# Altium project ROBOT_PCB_PROJECT.PrjPcb (part 1 of 2)
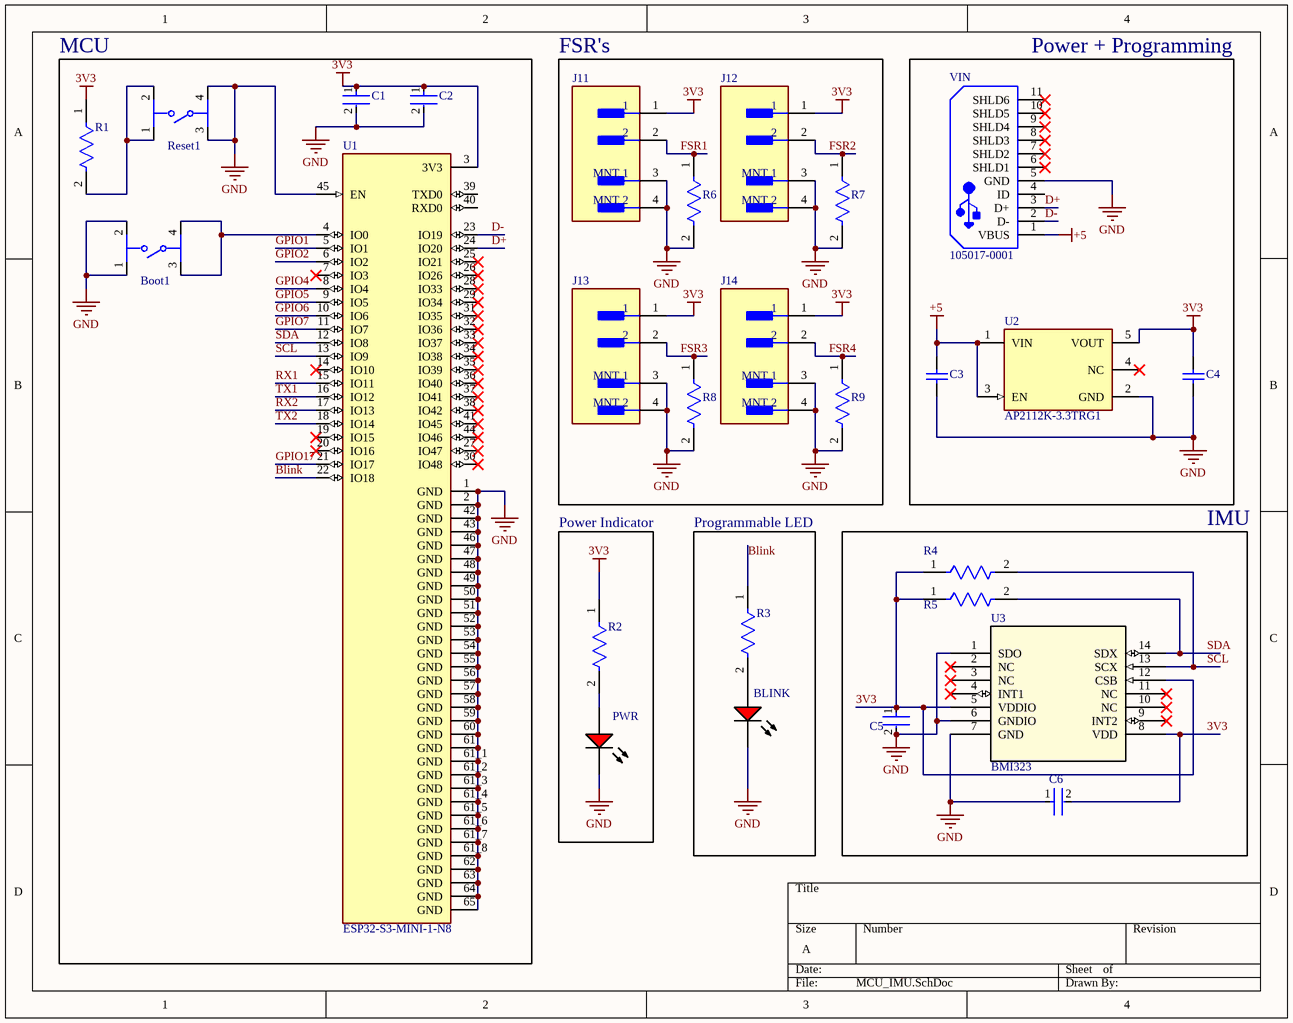
[diagram p0: MCU_IMU.SchDoc]
4 sheets, 150 parts. Net scope: global (net labels, ports and power ports of the same name join across sheets).
Board file: ROBOT_MOTHERBOARD.PcbDoc
Sheets:
  MCU_IMU.SchDoc
  UART_LOGIC.SchDoc
  Battery_power.SchDoc
  Jetson_power.SchDoc

## Sheet MCU_IMU.SchDoc
size A; SheetNumber: 1; SheetTotal: 4

### Parts
BLINK  SML-LX1206IC-TR  [LUMX-SML-LX1206IC_V]  (value not drawn)
Boot1  PTS810SJM250SMTRLFS  [FP-PTS810SJM250SMTRLFS-MFG]  (value not drawn)
C1  CC0805KRX7R9BB104  [FP-CC0805-0_85-MFG]  (value not drawn)
C2  CC0805KRX7R9BB104  [FP-CC0805-0_85-MFG]  (value not drawn)
C3  C0805C105K5RACTU  [CAPC2013X140X50ML20T25]  (value not drawn)
C4  C0805C105K5RACTU  [CAPC2013X140X50ML20T25]  (value not drawn)
C5  CC0805KRX7R9BB104  [FP-CC0805-0_85-MFG]  (value not drawn)
C6  CC0805KRX7R9BB104  [FP-CC0805-0_85-MFG]  (value not drawn)
J11  BM02B-SRSS-TBT(LF)(SN)  [FP-BM02B-SRSS-TBT_LF_SN-MFG]  (value not drawn)
J12  BM02B-SRSS-TBT(LF)(SN)  [FP-BM02B-SRSS-TBT_LF_SN-MFG]  (value not drawn)
J13  BM02B-SRSS-TBT(LF)(SN)  [FP-BM02B-SRSS-TBT_LF_SN-MFG]  (value not drawn)
J14  BM02B-SRSS-TBT(LF)(SN)  [FP-BM02B-SRSS-TBT_LF_SN-MFG]  (value not drawn)
PWR  SML-LX1206IC-TR  [LUMX-SML-LX1206IC_V]  (value not drawn)
R1  CRCW08054K70FKEA  [FP-CRCW0805-e3-IPC_B]  (value not drawn)
R2  CRCW08054K70FKEA  [FP-CRCW0805-e3-IPC_B]  (value not drawn)
R3  CRCW08054K70FKEA  [FP-CRCW0805-e3-IPC_B]  (value not drawn)
R4  CRCW08054K70FKEA  [FP-CRCW0805-e3-IPC_B]  (value not drawn)
R5  CRCW08054K70FKEA  [FP-CRCW0805-e3-IPC_B]  (value not drawn)
R6  RC0603FR-0710KL  [FP-RC0603-0_55-IPC_C]  (value not drawn)
R7  RC0603FR-0710KL  [FP-RC0603-0_55-IPC_C]  (value not drawn)
R8  RC0603FR-0710KL  [FP-RC0603-0_55-IPC_C]  (value not drawn)
R9  RC0603FR-0710KL  [FP-RC0603-0_55-IPC_C]  (value not drawn)
Reset1  PTS810SJM250SMTRLFS  [FP-PTS810SJM250SMTRLFS-MFG]  (value not drawn)
U1  ESP32-S3-MINI-1-N8  [XCVR_ESP32-S3-MINI-1-N8]
U2  AP2112K-3.3TRG1  [FP-SOT25-IPC_A]
U3  BMI323  [BMI323_BOS]
VIN  105017-0001  [USB-MICRO-B_V]

### Blocks framed on the sheet
MCU: Boot1 C1 C2 R1 Reset1 U1
FSR's: J11-J14 R6-R9
Power + Programming: C3 C4 U2 VIN
Power Indicator: PWR R2
Programmable LED: BLINK R3
IMU: C5 C6 R4 R5 U3

### Nets
3V3: C1.1 C2.1 C4.2 C5.1 C6.2 J11.1 J12.1 J13.1 J14.1 R1.1 R2.1 R4.1 R5.1 U1.3(3V3) U2.5(VOUT) U3.5(VDDIO) U3.8(VDD) U3.12(CSB)
+5: C3.2 U2.1(VIN) U2.3(EN) VIN.1(VBUS)
GND: BLINK.2(K) Boot1.1 Boot1.2 C1.2 C2.2 C3.1 C4.1 C5.2 C6.1 J11.3(MNT_1) J11.4(MNT_2) J12.3(MNT_1) J12.4(MNT_2) J13.3(MNT_1) J13.4(MNT_2) J14.3(MNT_1) J14.4(MNT_2) PWR.2(K) R6.2 R7.2 R8.2 R9.2 Reset1.3 Reset1.4 U1.1(GND) U1.2(GND) U1.42(GND) U1.43(GND) U1.45(EN) U1.46(GND) U1.47(GND) U1.48(GND) U1.49(GND) U1.50(GND) U1.51(GND) U1.52(GND) U1.53(GND) U1.54(GND) U1.55(GND) U1.56(GND) U1.57(GND) U1.58(GND) U1.59(GND) U1.60(GND) U1.61(GND) U1.61_1(GND) U1.61_2(GND) U1.61_3(GND) U1.61_4(GND) U1.61_5(GND) U1.61_6(GND) U1.61_7(GND) U1.61_8(GND) U1.62(GND) U1.63(GND) U1.64(GND) U1.65(GND) U2.2(GND) U3.1(SDO) U3.6(GNDIO) U3.7(GND) VIN.5(GND)
Blink: R3.1 U1.22(IO18)
D+: U1.24(IO20) VIN.3(D+)
D-: U1.23(IO19) VIN.2(D-)
FSR1: J11.2 R6.1
FSR2: J12.2 R7.1
FSR3: J13.2 R8.1
FSR4: J14.2 R9.1
GPIO1: U1.5(IO1)
GPIO2: U1.6(IO2)
GPIO4: U1.8(IO4)
GPIO5: U1.9(IO5)
GPIO6: U1.10(IO6)
GPIO7: U1.11(IO7)
GPIO17: U1.21(IO17)
RX1: U1.15(IO11)
RX2: U1.17(IO13)
SCL: R4.2 U1.13(IO9) U3.13(SCX)
SDA: R5.2 U1.12(IO8) U3.14(SDX)
TX1: U1.16(IO12)
TX2: U1.18(IO14)
NetBLINK_1: BLINK.1(A) R3.2
NetBoot1_3: Boot1.3 Boot1.4 U1.4(IO0)
NetPWR_1: PWR.1(A) R2.2
NetR1_2: R1.2 Reset1.1 Reset1.2

Not connected (* = marked no-connect by the designer): U1 7(IO3)* 14(IO10)* 19(IO15)* 20(IO16)* 25(IO21)* 26(IO26)* 27(IO47)* 28(IO33)* 29(IO34)* 30(IO48)* 31(IO35)* 32(IO36)* 33(IO37)* 34(IO38)* 35(IO39)* 36(IO40)* 37(IO41)* 38(IO42)* 39(TXD0) 40(RXD0) 41(IO45)* 44(IO46)*; U2 4(NC)*; U3 2(NC)* 3(NC)* 4(INT1)* 9(INT2)* 10(NC)* 11(NC)*; VIN 4(ID) 6(SHLD1)* 7(SHLD2)* 8(SHLD3)* 9(SHLD4)* 10(SHLD5)* 11(SHLD6)*

### Library data of the parts
BLINK PWR = CMP-2000-07123-1: LED Red, 65 mW, -40 to 85 degC, 2-Pin SMD, RoHS, Tape and Reel; Manufacturer: Lumex; LED Material: GaAsP; Peak Wavelength: 635nm; Number of LEDs: 1; Viewing Angle: 160; Reverse Voltage: 5(Min)V; Lens Appearance: ColorlessNonDiffused; Intensity: 6mcd; Pin_Count: 2; Lens Dimensions: 2x1.6x0.5mm; Mounting: SurfaceMount; ECCN: EAR99; RoHS: Unknown; Package Description: 2-Pin Surface Mount Device, Body 3.2 x 1.5 mm; Mounting Technology: SurfaceMount; Dominant Wavelength: N/A; Supplier_Package: SMD; Supplier Standard Pack: 3,000; Color: Red; Dimension: 3.2x1.6x1.1mm; HTS: 8541402000; Part No: SML-LX1206IC-TR; Family: SML-LX1206IC; Supplier: Lumex; Datasheet URL: http://www.lumex.com/content/files/ProductAttachment/SML-LX1206IC-TR.pdf; Package Reference: SML-LX1206IC; Manufacturer URL: http://www.lumexinstruments.com/; Type: Uni-Color; Operating Temperature: -25to85C; Packaging: TapeandReel; Datasheet Version: Rev. J, 08/2012
Boot1 Reset1 = CMP-10040-000001-2: SWITCH TACTILE SPST-NO 0.05A 16V; Throw Configuration: SPST; Operating Force: 160gf; Actuator Type: Standard; Switch Travel: 0.15mm; Switch Function: Off-Mom; Max Current Rating: 50mA; Mechanical Life: 150000Cycles; Illumination Type: Non-Illuminated; Package Quantity: 2900; Depth: 4.6mm; Mount: Surface Mount; Packaging: Tape and Reel; Length: 3.2mm; RoHS Compliant: Yes; Case/Package: SMD/SMT; Voltage Rating (DC): 16V; Min Operating Temperature: -40°C; Termination: J-Bend; Lead Free: Lead Free; Contact Plating: Silver; Orientation: Straight; Max Operating Temperature: 85°C; Current Rating: 50mA; Color: Black
C1 C2 C5 C6 = CMP-2100-03606-3: CAP CER 0.1UF 50V X7R 0805; Manufacturer: Yageo; Tolerance: 0.1; Capacitance: 100 nF; Value: 100 nF; Material: Ceramic; Device Class L1: Passive Components; ComponentLink2Description: Datasheet; Package: CC0805-0.85; Manufacturer Part Number: CC0805KRX7R9BB104; Digikey Description: CAP CER 0.1UF 50V X7R 0805; Device Class L3: Ceramic Capacitors; Temperature: -30°C to +85°C; Temperature Characteristic: X7R; Voltage Rating: 50 V; Height: 0.95mm; RoHS: TRUE; Ipc Land Pattern Name: CAPC200125X85; Device Class L2: Capacitors; Category: Cap; Temperature Range Low: -30°C; Temperature Range High: +85°C; Mouser Description: Multilayer Ceramic Capacitors MLCC - SMD/SMT 100nF 50V X7R 10%; Footprint Url: http://www.yageo.com/exep/pages/download/literatures/UPY-C_GEN_24.pdf; Automotive: No; Octopart: https://octopart.com/cc0805krx7r9bb104-yageo-192993; Lead Free: Yes; ComponentLink2URL: http://www.yageo.com/documents/recent/UPY-GPHC_Y5V_6.3V-to-50V_8.pdf
C3 C4 = CMP-2007-03236-1: Manufacturer: Kemet; Part Number: C0805C105K5RACTU
J11-J14 = CMP-17439-000179-1: CONN WIRE HDR 2POS 1MM STSMD; Mated Stacking Heights: 4.9mm; Max Current Rating: 1A; Pitch: 0.039inch; Contact Resistance: 20mR; Max Voltage Rating (DC): 50V; Connector Type: Header; Number of Positions: 2; Insulation Material: Nylon; Termination: Solder; Contact Plating: Tin; Mount: Surface Mount; Package Quantity: 1500; Housing Color: Natural; Orientation: Straight; Max Operating Temperature: 85°C; Min Operating Temperature: -25°C; Length: 4mm; Lead Free: Lead Free; Contact Type: Male Pin; Depth: 3.6mm; Contact Material: Copper Alloy; Packaging: Tape and Reel; Number of Rows: 1; Contact Shape: Square; Flammability Rating: UL94 V-0; Voltage Rating: 50V; Color: Natural; Contact Finish - Mating: TIN; Fastening Type: Pull; Insulation Color: Natural; Series: SR; Max Voltage Rating (AC): 50V; Housing Material: Polyamide
R1-R5 = CMP-2100-03615-2: RES Thick Film, 4.7kΩ, 1%, 0.125W, 100ppm/°C, 0805; Max Power Dissipation: 125mW; Resistance: 4.7kR; Voltage Rating: 150V; Termination: SMD/SMT; Weight: 0.000194oz; Case/Package: 0805; Number of Terminations: 2; Min Operating Temperature: -55°C; Case Code (Metric): 2012; Package Quantity: 10; Depth: 1.25mm; Military Standard: Not; Composition: Thick Film; Radiation Hardening: No; Contact Plating: Tin; Height: 0.45mm; Power Rating: 125mW; Features: Automotive AEC-Q200; Tolerance: 1%; Packaging: Tape and Reel; Max Operating Temperature: 155°C; Length: 2mm; Case Code (Imperial): 0805; Voltage Rating (DC): 150V; Width: 1.25mm; Temperature Coefficient: 100ppm/°C; Lead Free: Lead Free
R6-R9 = CMP-2100-03664-2: RES 10K OHM 1% 1/10W 0603; Voltage Rating: 75V; Voltage Rating (DC): 50V; Resistance: 10kR; Power Rating: 100mW; Temperature Coefficient: 100ppm/°C; Depth: 0.8mm; Termination: SMD/SMT; Resistor Type: Thick Film; Series: RC; Construction: Rectangular; Features: Moisture Resistant; Packaging: Tape and Reel; Min Operating Temperature: -55°C; Number of Terminations: 2; Lead Pitch: 0.3mm; RoHS Compliant: Yes; Case/Package: 0603; Resistance Tolerance: 1%; Military Standard: Not; Weight: 7.1E-05oz; Number of Pins: 2; Tolerance: 1%; Length: 1.6mm; Case Code (Imperial): 0603; Lead Free: Lead Free; Width: 0.8mm; Max Power Dissipation: 100mW; Height: 0.45mm; Max Operating Temperature: 155°C; Case Code (Metric): 1608; Size Code: 0603
U1 = CMP-025-000000-2: MF: {'manufacturer': u'Espressif Systems'}; Pin Count: 73; Component Type: Standard; Design Item ID: ESP32-S3-MINI-1-N8; Source: ESP32-S3-MINI-1-N8.SchLib; MP: ESP32-S3-MINI-1-N8; Price: None; Package: None; Value: *
U2 = CMP-12756-000035-1: IC REG LINEAR 3.3V 600MA SOT25; Number of Regulators: 1; Output Type: Fixed; Polarity: Positive; Min Input Voltage: 2.5V; Max Input Voltage: 6V; Accuracy: 1.5%; Quiescent Current: 55uA; Dropout Voltage: 250mV; Min Operating Temperature: -40°C; Length: 3.1mm; Output Current: 600mA; Max Operating Temperature: 85°C; Package Quantity: 1; Output Voltage: 3.3V; Width: 1.7mm; Number of Outputs: 1; Packaging: Tape and Reel; Height: 1.3mm; Lead Free: Lead Free; Max Output Current: 600mA; Case/Package: SOT-23-5; Mount: Surface Mount; Number of Pins: 5
U3 = BMI323: No Description Available; Manufacturer_Name: Bosch Sensortec; Copyright: Copyright (C) 2025 Ultra Librarian. All rights reserved.; Manufacturer_Part_Number: BMI323; RefDes: RefDes; Type: Type
VIN = CMP-2000-05827-1: Micro-USB B Receptacle, Right Angle, Bottom Mount, Surface Mount, with Solder Tabs, -30 to 85 degC, 5-Pin USB, RoHS, Tape and Reel; Manufacturer: Molex; Featured Product: Micro-USBConnectorsUSBConnectors; Other Names: WM1399DKR; Package Version: Rev. F, 12/2012; Number of Contacts: 5; Connector Type: USB-microB; Catalog Drawings: 1050170001; 3D Model: 105017-0001.stp; Mating Products: WM17145-ND-CABLEMICROUSBBTOSTDA1.0MWM17147-ND-CABLEMICROUSBBTOSTDA2.0MWM17146-ND-CABLEMICROUSBBTOSTDA1.5M; PCN Assembly/Origin: ResinSupplier21/Oct/2015; Voltage - Max: 30V; Online Catalog: Molex-MicroUSB; Manufacturer URL: http://www.molex.com/; Package Description: 5-Leads USB, Micro B, Body 7.5 x 5 mm, Pitch 0.65 mm; Datasheet URL: http://www.molex.com/elqNow/elqRedir.htm?ref=http://www.molex.com/webdocs/datasheets/pdf/en-us/1050170001_IO_CONNECTORS.pdf; Ingress Protection: -; Datasheet Version: 03/2016; Mounting Type: BoardCutout,SurfaceMount,RightAngle; Circuits: 5; Standard Package: 1; Package Reference: MICRO-B; Package URL: http://www.molex.com/pdm_docs/sd/1050170001_sd.pdf; Category: Connectors,Interconnects; Series: -; RoHS Information: 1050170001CertofCompliance; Features: Shielded,SolderRetention; Family: USB,DVI,HDMIConnectors; Specifications: -; Gender: Receptacle; Packaging: Digi-Reel®; Mounting Technology: SurfaceMount

## Sheet UART_LOGIC.SchDoc
size A; SheetNumber: 2; SheetTotal: 4
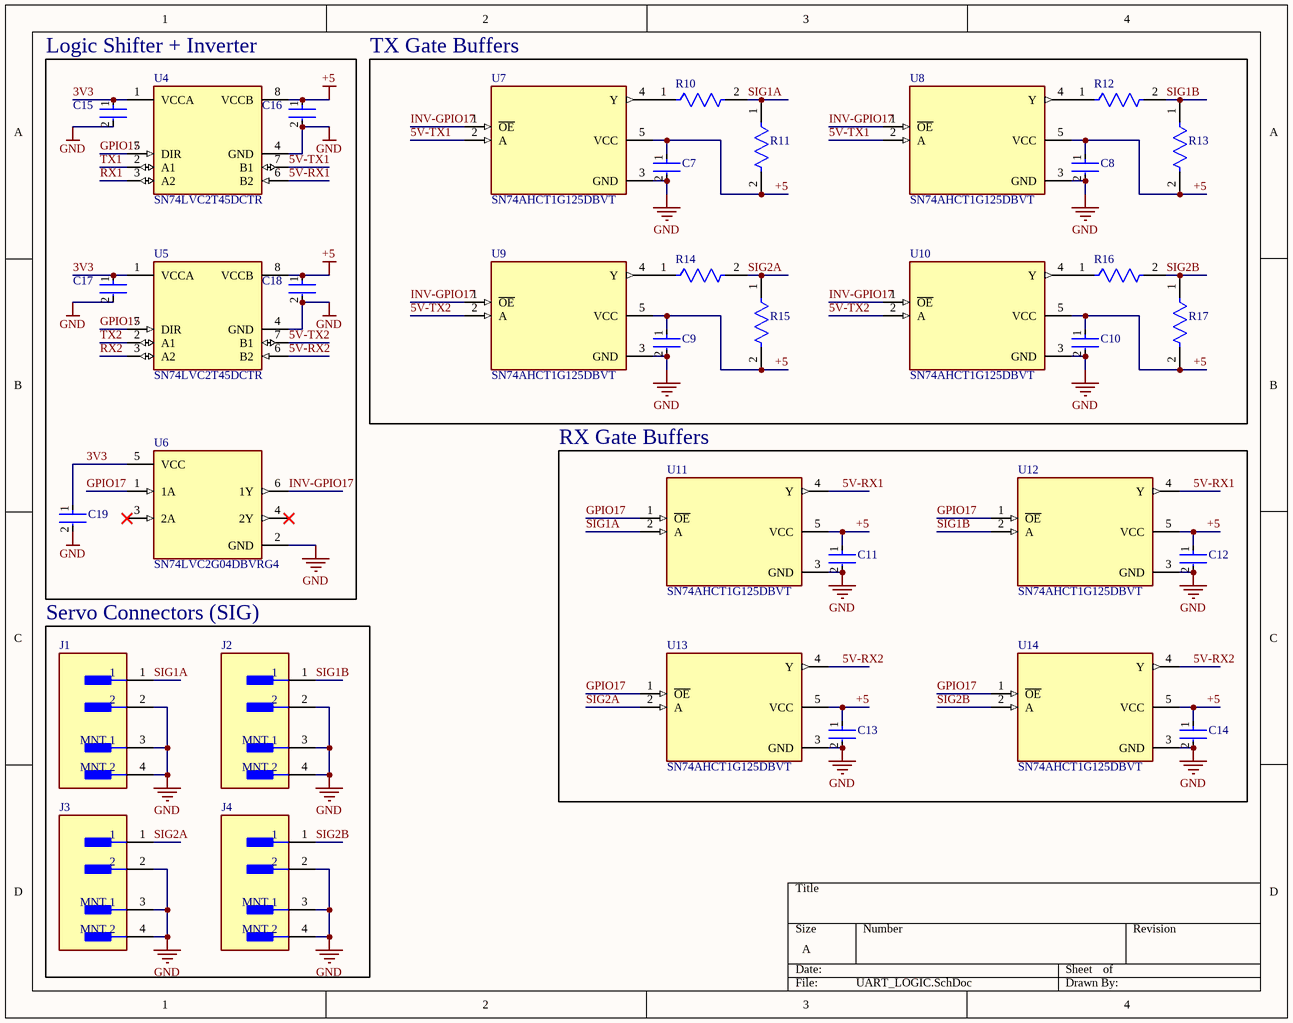
[diagram p1: UART_LOGIC.SchDoc]

### Parts
C7  CC0805KRX7R9BB104  [FP-CC0805-0_85-MFG]  (value not drawn)
C8  CC0805KRX7R9BB104  [FP-CC0805-0_85-MFG]  (value not drawn)
C9  CC0805KRX7R9BB104  [FP-CC0805-0_85-MFG]  (value not drawn)
C10  CC0805KRX7R9BB104  [FP-CC0805-0_85-MFG]  (value not drawn)
C11  CC0805KRX7R9BB104  [FP-CC0805-0_85-MFG]  (value not drawn)
C12  CC0805KRX7R9BB104  [FP-CC0805-0_85-MFG]  (value not drawn)
C13  CC0805KRX7R9BB104  [FP-CC0805-0_85-MFG]  (value not drawn)
C14  CC0805KRX7R9BB104  [FP-CC0805-0_85-MFG]  (value not drawn)
C15  CC0805KRX7R9BB104  [FP-CC0805-0_85-MFG]  (value not drawn)
C16  CC0805KRX7R9BB104  [FP-CC0805-0_85-MFG]  (value not drawn)
C17  CC0805KRX7R9BB104  [FP-CC0805-0_85-MFG]  (value not drawn)
C18  CC0805KRX7R9BB104  [FP-CC0805-0_85-MFG]  (value not drawn)
C19  CC0805KRX7R9BB104  [FP-CC0805-0_85-MFG]  (value not drawn)
J1  BM02B-SRSS-TBT(LF)(SN)  [FP-BM02B-SRSS-TBT_LF_SN-MFG]  (value not drawn)
J2  BM02B-SRSS-TBT(LF)(SN)  [FP-BM02B-SRSS-TBT_LF_SN-MFG]  (value not drawn)
J3  BM02B-SRSS-TBT(LF)(SN)  [FP-BM02B-SRSS-TBT_LF_SN-MFG]  (value not drawn)
J4  BM02B-SRSS-TBT(LF)(SN)  [FP-BM02B-SRSS-TBT_LF_SN-MFG]  (value not drawn)
R10  RMCF0603FG47R0  [FP-RMCF0603-IPC_A]  (value not drawn)
R11  RC0603FR-0710KL  [FP-RC0603-0_55-IPC_C]  (value not drawn)
R12  RMCF0603FG47R0  [FP-RMCF0603-IPC_A]  (value not drawn)
R13  RC0603FR-0710KL  [FP-RC0603-0_55-IPC_C]  (value not drawn)
R14  RMCF0603FG47R0  [FP-RMCF0603-IPC_A]  (value not drawn)
R15  RC0603FR-0710KL  [FP-RC0603-0_55-IPC_C]  (value not drawn)
R16  RMCF0603FG47R0  [FP-RMCF0603-IPC_A]  (value not drawn)
R17  RC0603FR-0710KL  [FP-RC0603-0_55-IPC_C]  (value not drawn)
U4  SN74LVC2T45DCTR  [FP-DCT0008A-IPC_C]
U5  SN74LVC2T45DCTR  [FP-DCT0008A-IPC_C]
U6  SN74LVC2G04DBVRG4  [FP-DBV0006A-MFG]
U7  SN74AHCT1G125DBVT  [SOT95P280X145-5N]
U8  SN74AHCT1G125DBVT  [SOT95P280X145-5N]
U9  SN74AHCT1G125DBVT  [SOT95P280X145-5N]
U10  SN74AHCT1G125DBVT  [SOT95P280X145-5N]
U11  SN74AHCT1G125DBVT  [SOT95P280X145-5N]
U12  SN74AHCT1G125DBVT  [SOT95P280X145-5N]
U13  SN74AHCT1G125DBVT  [SOT95P280X145-5N]
U14  SN74AHCT1G125DBVT  [SOT95P280X145-5N]

### Blocks framed on the sheet
Logic Shifter + Inverter: C15-C19 U4-U6
TX Gate Buffers: C7-C10 R10-R17 U7-U10
RX Gate Buffers: C11-C14 U11-U14
Servo Connectors (SIG): J1-J4

### Nets
3V3: C15.1 C17.1 C19.1 U4.1(VCCA) U5.1(VCCA) U6.5(VCC)
+5: C7.1 C8.1 C9.1 C10.1 C11.1 C12.1 C13.1 C14.1 C16.1 C18.1 R11.2 R13.2 R15.2 R17.2 U4.8(VCCB) U5.8(VCCB) U7.5(VCC) U8.5(VCC) U9.5(VCC) U10.5(VCC) U11.5(VCC) U12.5(VCC) U13.5(VCC) U14.5(VCC)
GND: C7.2 C8.2 C9.2 C10.2 C11.2 C12.2 C13.2 C14.2 C15.2 C16.2 C17.2 C18.2 C19.2 J1.2 J1.3(MNT_1) J1.4(MNT_2) J2.2 J2.3(MNT_1) J2.4(MNT_2) J3.2 J3.3(MNT_1) J3.4(MNT_2) J4.2 J4.3(MNT_1) J4.4(MNT_2) U4.4(GND) U5.4(GND) U6.2(GND) U7.3(GND) U8.3(GND) U9.3(GND) U10.3(GND) U11.3(GND) U12.3(GND) U13.3(GND) U14.3(GND)
5V-RX1: U4.6(B2) U11.4(Y) U12.4(Y)
5V-RX2: U5.6(B2) U13.4(Y) U14.4(Y)
5V-TX1: U4.7(B1) U7.2(A) U8.2(A)
5V-TX2: U5.7(B1) U9.2(A) U10.2(A)
GPIO17: U4.5(DIR) U5.5(DIR) U6.1(1A) U11.1(~{OE}) U12.1(~{OE}) U13.1(~{OE}) U14.1(~{OE})
INV-GPIO17: U6.6(1Y) U7.1(~{OE}) U8.1(~{OE}) U9.1(~{OE}) U10.1(~{OE})
RX1: U4.3(A2)
RX2: U5.3(A2)
SIG1A: J1.1 R10.2 R11.1 U11.2(A)
SIG1B: J2.1 R12.2 R13.1 U12.2(A)
SIG2A: J3.1 R14.2 R15.1 U13.2(A)
SIG2B: J4.1 R16.2 R17.1 U14.2(A)
TX1: U4.2(A1)
TX2: U5.2(A1)
NetR10_1: R10.1 U7.4(Y)
NetR12_1: R12.1 U8.4(Y)
NetR14_1: R14.1 U9.4(Y)
NetR16_1: R16.1 U10.4(Y)

Not connected (* = marked no-connect by the designer): U6 3(2A)* 4(2Y)*

### Library data of the parts
C7-C19 = CMP-2100-03606-3: as C1 on sheet MCU_IMU; Device Class L1: Passive Components; ComponentLink2Description: Datasheet; Package: CC0805-0.85; Manufacturer Part Number: CC0805KRX7R9BB104; Digikey Description: CAP CER 0.1UF 50V X7R 0805; Device Class L3: Ceramic Capacitors; Temperature: -30°C to +85°C; Temperature Characteristic: X7R; Voltage Rating: 50 V; Height: 0.95mm; RoHS: TRUE; Ipc Land Pattern Name: CAPC200125X85; Device Class L2: Capacitors; Category: Cap; Temperature Range Low: -30°C; Temperature Range High: +85°C; Mouser Description: Multilayer Ceramic Capacitors MLCC - SMD/SMT 100nF 50V X7R 10%; Footprint Url: http://www.yageo.com/exep/pages/download/literatures/UPY-C_GEN_24.pdf; Automotive: No; Octopart: https://octopart.com/cc0805krx7r9bb104-yageo-192993; Lead Free: Yes; ComponentLink2URL: http://www.yageo.com/documents/recent/UPY-GPHC_Y5V_6.3V-to-50V_8.pdf
J1-J4 = CMP-17439-000179-1: as J11 on sheet MCU_IMU; Insulation Material: Nylon; Termination: Solder; Contact Plating: Tin; Mount: Surface Mount; Package Quantity: 1500; Housing Color: Natural; Orientation: Straight; Max Operating Temperature: 85°C; Min Operating Temperature: -25°C; Length: 4mm; Lead Free: Lead Free; Contact Type: Male Pin; Depth: 3.6mm; Contact Material: Copper Alloy; Packaging: Tape and Reel; Number of Rows: 1; Contact Shape: Square; Flammability Rating: UL94 V-0; Voltage Rating: 50V; Color: Natural; Contact Finish - Mating: TIN; Fastening Type: Pull; Insulation Color: Natural; Series: SR; Max Voltage Rating (AC): 50V; Housing Material: Polyamide
R10 R12 R14 R16 = CMP-26527-000678-1: 47Ω ±1% 0.1W 0603 Thick Film Chip Resistor AEC-Q200 compliant; Power Rating: 100mW; Resistance: 47R; Case/Package: 0603; RoHS Compliant: Yes
R11 R13 R15 R17 = CMP-2100-03664-2: as R6 on sheet MCU_IMU; Depth: 0.8mm; Termination: SMD/SMT; Resistor Type: Thick Film; Series: RC; Construction: Rectangular; Features: Moisture Resistant; Packaging: Tape and Reel; Min Operating Temperature: -55°C; Number of Terminations: 2; Lead Pitch: 0.3mm; RoHS Compliant: Yes; Case/Package: 0603; Resistance Tolerance: 1%; Military Standard: Not; Weight: 7.1E-05oz; Number of Pins: 2; Tolerance: 1%; Length: 1.6mm; Case Code (Imperial): 0603; Lead Free: Lead Free; Width: 0.8mm; Max Power Dissipation: 100mW; Height: 0.45mm; Max Operating Temperature: 155°C; Case Code (Metric): 1608; Size Code: 0603
U4 U5 = CMP-0000-1: 2-Bit Dual Supply Transceiver with Configurable Voltage-Level Shifting and 3-State Outputs 8-SSOP -40 to 85; Manufacturer Lifecycle Status: ACTIVE; High Level Output Current: -32mA; Low Level Output Current: 32mA; Min Supply Voltage: 1.65V; Max Junction Temperature (Tj): 150°C; Polarity: Non-Inverting; Max Supply Voltage: 5.5V; Turn-On Delay Time: 17.7ns; Number of Channels: 2; Quiescent Current: 3µA; Number of Circuits: 1; Direction: Bidirectional; Data Rate: 420Mbps; Logic Function: Transceiver, Translator; Output Current: 50mA; Propagation Delay: 45.2ns; Packaging: Cut Tape; Contact Plating: Gold; Min Operating Temperature: -40°C; Ambient Temperature Range High: 85°C; Max Operating Temperature: 85°C; Height: 1.3mm; Width: 2.8mm; RoHS: Compliant; REACH SVHC: No; Length: 2.95mm; Weight: 23.388357mg; Lifecycle Status: Production; Schedule B: 8542390000, 8542390000; Pins: 8; Lead Free: Lead Free; Number of Bits: 2; Radiation Hardening: No; Number of Inputs: 1; Number of Elements: 1; Number of Outputs: 1; Thickness: 1.29mm; Case/Package: SSOP
U6 = CMP-04903-000086-1: IC INVERTER 2CH 2-INP SOT23-6; Quiescent Current: 10uA; Number of Elements: 2; Propagation Delay: 3.7ns; Min Supply Voltage: 1.65V; High Level Output Current: -32mA; Max Supply Voltage: 5.5V; Low Level Output Current: 32mA; Operating Supply Voltage: 5V; Turn-On Delay Time: 8ns; Mount: Surface Mount; Min Operating Temperature: -40°C; Logic Function: Inverter; Lead Free: Lead Free; Number of Bits: 2; Number of Pins: 6; Radiation Hardening: No; Max Operating Temperature: 125°C; Number of Circuits: 2; Weight: 0.000557oz; Number of Inputs: 2; RoHS Compliant: Yes; Technology: CMOS; Packaging: Tape and Reel; Number of Gates: 2; Case/Package: SOT-23-6; Package Quantity: 3000; Series: 74LVC
U7-U14 = CMP-009-000000-3: Single 4.5-V to 5.5-V buffer with TTL-compatible CMOS inputs and 3-state outputs; MF: Texas Instruments; Pin Count: 5; Design Item ID: SN74AHCT1G125DBVT; Value: *; Source: SN74AHCT1G125DBVT.SchLib; Check_prices: https://www.snapeda.com/parts/SN74AHCT1G125DBVT/Texas+Instruments/view-part/?ref=eda; Package: SOT-23-5 Texas Instruments; MP: SN74AHCT1G125DBVT; Component Type: Standard; SnapEDA_Link: https://www.snapeda.com/parts/SN74AHCT1G125DBVT/Texas+Instruments/view-part/?ref=snap

## Sheet Battery_power.SchDoc
size A; SheetNumber: 3; SheetTotal: 4
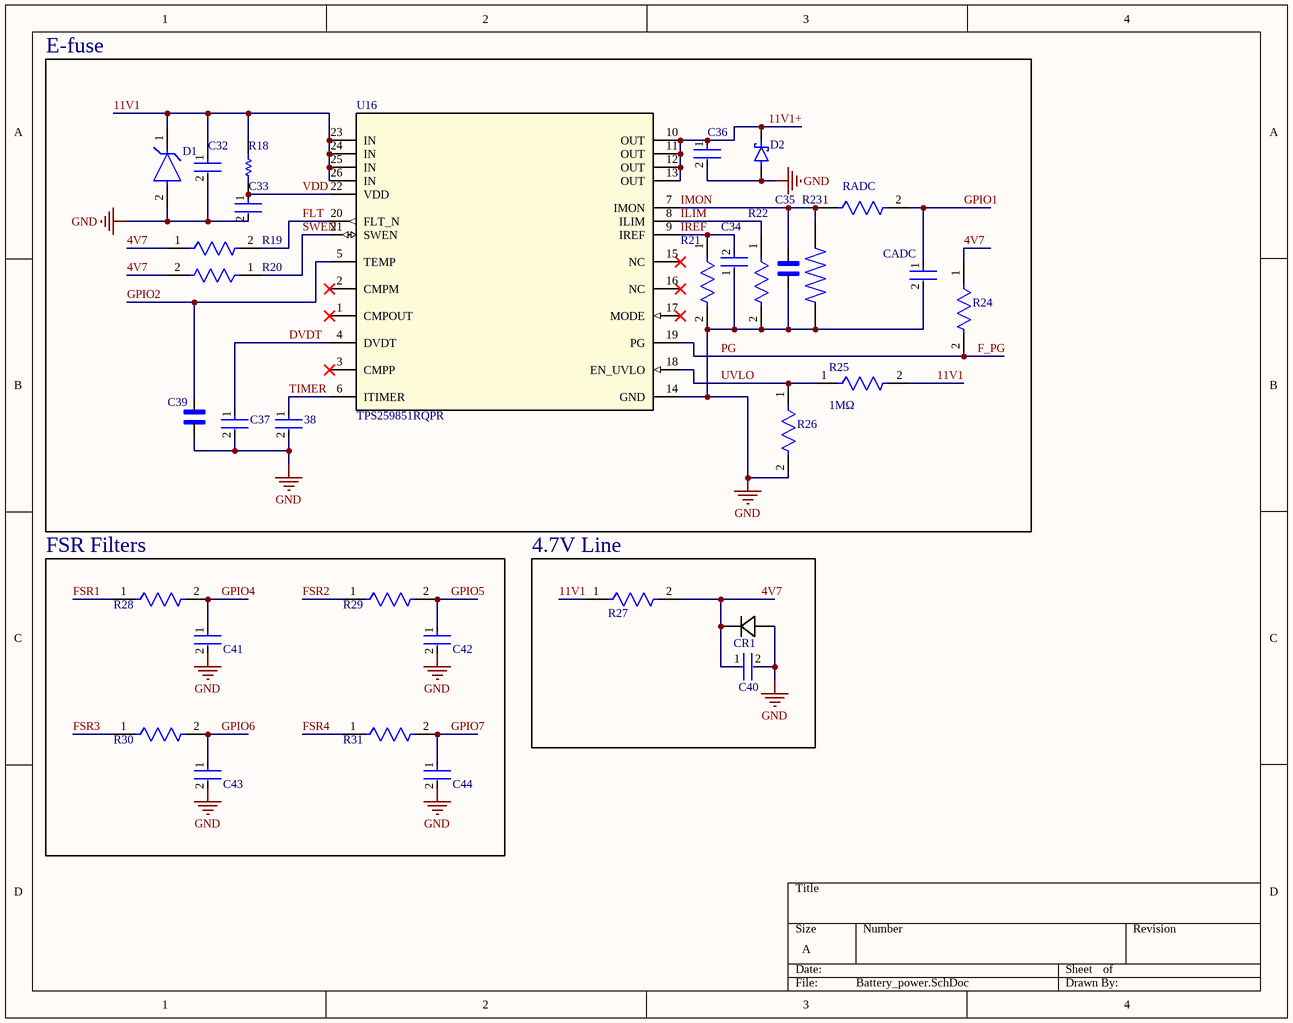
[diagram p2: Battery_power.SchDoc]

### Parts
38  GRM155R71H104KE14D  [FP-GRM155-0_05-IPC_B]  (value not drawn)
C32  CC0805KRX7R9BB104  [FP-CC0805-0_85-MFG]  (value not drawn)
C33  CC0805KKX7R9BB225  [FP-CC0805-0_85-MFG]  (value not drawn)
C34  C1608C0G1E472J080AA  [FP-C1608-080-0_1-IPC_A]  (value not drawn)
C35  GRM1885C1H101JA01D  [CAPC1608X90N]  (value not drawn)
C36  CC0805KKX7R9BB225  [FP-CC0805-0_85-MFG]  (value not drawn)
C37  GRM155R71H104KE14D  [FP-GRM155-0_05-IPC_B]  (value not drawn)
C39  GRM1885C1H101JA01D  [CAPC1608X90N]  (value not drawn)
C40  GRM155R71H104KE14D  [FP-GRM155-0_05-IPC_B]  (value not drawn)
C41  GRM155R71H104KE14D  [FP-GRM155-0_05-IPC_B]  (value not drawn)
C42  GRM155R71H104KE14D  [FP-GRM155-0_05-IPC_B]  (value not drawn)
C43  GRM155R71H104KE14D  [FP-GRM155-0_05-IPC_B]  (value not drawn)
C44  GRM155R71H104KE14D  [FP-GRM155-0_05-IPC_B]  (value not drawn)
CADC  CGA4C2C0G1H822J060AA  [FP-CGA4J-IPC_A]  (value not drawn)
CR1  BZT52C4V7-7-F  [SOD123_DIO]  (value not drawn)
D1  SMBJ12A  [FP-SMBJ-MFG]  (value not drawn)
D2  PDS1040-13  [DIO_PDS1040-13]  (value not drawn)
R18  CRCW040210R0FKED  [RESC1005X40X25NL05T05]  (value not drawn)
R19  CRCW040210K0FKEDC  [FP-CRCW0402-C-e3-IPC_C]  (value not drawn)
R20  CRCW0402100KFKED  [FP-CRCW0402-e3-IPC_C]  (value not drawn)
R21  RT0402BRD0748K7L  [FP-RT0402-MFG]  (value not drawn)
R22  RC0402FR-07499RL  [FP-RC0402-0_4-IPC_A]  (value not drawn)
R23  ERA3AEB102V  [RES_ERA3AEB102V]  (value not drawn)
R24  CRCW040210K0FKEDC  [FP-CRCW0402-C-e3-IPC_C]  (value not drawn)
R25  CRCW04021M00FKED  [CRCW0402-e3_MFG]  (value not drawn)
R26  CRCW0402121KFKED  [FP-CRCW0402-e3-MFG]  (value not drawn)
R27  RC0603FR-0710KL  [FP-RC0603-0_55-IPC_C]  (value not drawn)
R28  CRCW08054K70FKEA  [FP-CRCW0805-e3-IPC_B]  (value not drawn)
R29  CRCW08054K70FKEA  [FP-CRCW0805-e3-IPC_B]  (value not drawn)
R30  CRCW08054K70FKEA  [FP-CRCW0805-e3-IPC_B]  (value not drawn)
R31  CRCW08054K70FKEA  [FP-CRCW0805-e3-IPC_B]  (value not drawn)
RADC  CRCW08054K70FKEA  [FP-CRCW0805-e3-IPC_B]  (value not drawn)
U16  TPS259851RQPR  [RQP0026A-MFG]

### Blocks framed on the sheet
E-fuse: 38 C32-C37 C39 CADC D1 D2 R18-R26 RADC U16
FSR Filters: C41-C44 R28-R31
4.7V Line: C40 CR1 R27

### Nets
GND: 38.2 C32.2 C33.2 C34.1 C35.1 C36.2 C37.2 C39.1 C40.2 C41.2 C42.2 C43.2 C44.2 CADC.2 CR1.2 D1.2(A) D2.1(A) D2.2(A__1) R21.2 R22.2 R23.1 R26.2 U16.14(GND)
4V7: C40.1 CR1.1 R19.1 R20.2 R24.1 R27.2
11V1: C32.1 D1.1(C) R18.1 R25.2 R27.1 U16.23(IN) U16.24(IN) U16.25(IN) U16.26(IN)
11V1+: C36.1 D2.3(K) U16.10(OUT) U16.11(OUT) U16.12(OUT) U16.13(OUT)
DVDT: C37.1 U16.4(DVDT)
F_PG: R24.2 U16.19(PG)  [also labelled PG]
FLT: R19.2 U16.20(FLT_N)
FSR1: R28.1
FSR2: R29.1
FSR3: R30.1
FSR4: R31.1
GPIO1: CADC.1 RADC.2
GPIO2: C39.2 U16.5(TEMP)
GPIO4: C41.1 R28.2
GPIO5: C42.1 R29.2
GPIO6: C43.1 R30.2
GPIO7: C44.1 R31.2
ILIM: R22.1 U16.8(ILIM)
IMON: C35.2 R23.2 RADC.1 U16.7(IMON)
IREF: C34.2 R21.1 U16.9(IREF)
SWEN: R20.1 U16.21(SWEN)
TIMER: 38.1 U16.6(ITIMER)
UVLO: R25.1 R26.1 U16.18(EN_UVLO)
VDD: C33.1 R18.2 U16.22(VDD)

Not connected (* = marked no-connect by the designer): U16 1(CMPOUT)* 2(CMPM)* 3(CMPP)* 15(NC)* 16(NC)* 17(MODE)*

### Library data of the parts
38 C37 C40-C44 = CMP-2008-04639-2: Chip Multilayer Ceramic Capacitors for General Purpose, 0402, 0.10uF, X7R, 15%, 10%, 50V; Dissipation Factor: 0.025%; Capacitance: 100nF; Weight: 0.000212oz; Thickness: 0.022inch; Voltage Rating (DC): 50V; Dielectric Material: Ceramic; Termination: SMD/SMT; Case/Package: 0402; Case Code (Imperial): 0402; Mount: Surface Mount; REACH SVHC: No SVHC; Resistor Type: Ceramic; Dielectric: X7R; Max Operating Temperature: 125°C; Voltage: 50V; Lead Free: Lead Free; Package Quantity: 10000; Packaging: Tape and Reel; Length: 1mm; Material: Ceramic; Height: 0.5mm; Depth: 0.5mm; Width: 0.5mm; Min Operating Temperature: -55°C; Tolerance: 10%; Case Code (Metric): 1005; Voltage Rating: 50V
C32 = CMP-2100-03606-3: as C1 on sheet MCU_IMU; Device Class L1: Passive Components; ComponentLink2Description: Datasheet; Package: CC0805-0.85; Manufacturer Part Number: CC0805KRX7R9BB104; Digikey Description: CAP CER 0.1UF 50V X7R 0805; Device Class L3: Ceramic Capacitors; Temperature: -30°C to +85°C; Temperature Characteristic: X7R; Voltage Rating: 50 V; Height: 0.95mm; RoHS: TRUE; Ipc Land Pattern Name: CAPC200125X85; Device Class L2: Capacitors; Category: Cap; Temperature Range Low: -30°C; Temperature Range High: +85°C; Mouser Description: Multilayer Ceramic Capacitors MLCC - SMD/SMT 100nF 50V X7R 10%; Footprint Url: http://www.yageo.com/exep/pages/download/literatures/UPY-C_GEN_24.pdf; Automotive: No; Octopart: https://octopart.com/cc0805krx7r9bb104-yageo-192993; Lead Free: Yes; ComponentLink2URL: http://www.yageo.com/documents/recent/UPY-GPHC_Y5V_6.3V-to-50V_8.pdf
C33 C36 = CMP-03422-001390-1: CAP CER 2.2UF 50V X7R 0805; Manufacturer: Yageo; Tolerance: 0.1; Material: Ceramic; ComponentLink2Description: Datasheet; ComponentLink2URL: http://www.yageo.com/documents/recent/UPY-GPHC_Y5V_6.3V-to-50V_8.pdf; Voltage Rating: 50 V; Device Class L2: Capacitors; Footprint Url: http://www.yageo.com/exep/pages/download/literatures/UPY-C_GEN_24.pdf; Device Class L3: Ceramic Capacitors; Temperature Range High: +85°C; Category: Cap; Lead Free: Yes; Height: 0.95mm; Automotive: No; Value: 2.2 uF; Temperature Range Low: -30°C; Octopart: https://octopart.com/cc0805kkx7r9bb225-yageo-51849248; Temperature Characteristic: X7R; Ipc Land Pattern Name: CAPC200125X85; Mouser Description: 0805 50 V 2.2 uF ±10% Tolerance X7R Multilayer Ceramic Capacitor; RoHS: TRUE; Temperature: -30°C to +85°C; Capacitance: 2.2 uF; Package: CC0805-0.85; Digikey Description: CAP CER 2.2UF 50V X7R 0805; Manufacturer Part Number: CC0805KKX7R9BB225; Device Class L1: Passive Components
C34 = CMP-08246-004785-1: Multilayer Ceramic Capacitors 4.7nF ±5% 25V C0G SMD 0603; Dielectric Material: Ceramic; RoHS Compliant: Yes; Tolerance: 5%; Thickness: 0.037inch; Voltage Rating: 25V; Number of Pins: 2; Series: C; Max Operating Temperature: 125°C; Lead Free: Lead Free; Case Code (Metric): 1608; Construction: Flat; Case/Package: 0603; Min Operating Temperature: -55°C; Mount: Surface Mount; Voltage Rating (DC): 25V; Depth: 0.8mm; Case Code (Imperial): 0603; Width: 0.031inch; Radiation Hardening: No; Package Quantity: 1; Weight: 7.1E-05oz; Length: 1.6mm; Packaging: Tape and Reel; Height: 0.8mm; Dielectric: C0G; Capacitance: 4.7nF; Termination: SMD/SMT
C35 C39 = CMP-001-00083-1: SMD Capacitor C0G(EIA) with Capacitance: 100pF Tol. 5%. Rated Voltage: 50Vdc; MF: Murata Electronics; Source: GRM1885C1H101JA01D.SchLib; MP: GRM1885C1H101JA01D; Value: 100pF; Component Type: Standard; Pins: 2; Case/Package: 1608 Murata; Design Item ID: GRM1885C1H101JA01D; SnapEDA_Link: https://www.snapeda.com/parts/GRM1885C1H101JA01D/Murata+Electronics+North+America/view-part/?ref=snap; Check_prices: https://www.snapeda.com/parts/GRM1885C1H101JA01D/Murata+Electronics+North+America/view-part/?ref=eda
CADC = CMP-08246-000542-1: Cap Ceramic 8.2nF 50V C0G 5% Pad SMD 0805 +125°C Automotive T/R; Capacitance: 8.2nF; Case/Package: 0805; Package Quantity: 1; Weight: 0.000194oz; Voltage Rating (DC): 50V; Composition: Ceramic; Min Operating Temperature: -55°C; Case Code (Metric): 2012; Length: 2mm; Packaging: Tape and Reel; Height: 0.6mm; REACH SVHC: No SVHC; Case Code (Imperial): 0805; Mount: Surface Mount; Voltage Rating: 50V; Dielectric: C0G; Max Operating Temperature: 125°C; Width: 0.049inch; Depth: 1.25mm; Tolerance: 5%; Termination: SMD/SMT; Thickness: 0.028inch; Ratings: AEC-Q200
CR1 = BZT52C4V7-7-F: No Description Available; Manufacturer_Name: Diodes Inc; Copyright: Copyright (C) 2026 Ultra Librarian. All rights reserved.; Manufacturer_Part_Number: BZT52C4V7-7-F
D1 = CMP-2000-07093-2: TVS DIODE 12V 19.9V DO214AA; Manufacturer: Littelfuse; Breakdown Voltage: 13.3V; Peak Pulse Current: 30.2A; Max Junction Temp: +150°C; Peak Pulse Power: 600W; Direction: Unidirectional; Number Of Channels: 1; Lead Free: Yes; Reverse Standoff Voltage: 12V; ComponentLink2URL: https://www.littelfuse.com/~/media/electronics/datasheets/tvs_diodes/littelfuse_tvs_diode_smbj_datasheet.pdf.pdf; RoHS: TRUE; Clamping Voltage: 19.9V; Octopart: https://octopart.com/smbj12a-littelfuse-28708; Automotive: No; Manufacturer Part Number: SMBJ12A; Package: SMBJ; Mouser Description: Diode; 30.2 A (Max.); 13.30 V (Min.) @ 1 mA; 5 uA (Max.) @ 12 V; 100 A (Max.); Temperature Range High: +150°C; Device Class L1: Circuit Protection; Category: Diode; Height: 2.61mm; ComponentLink2Description: Datasheet; Digikey Description: TVS DIODE 12V 19.9V DO214AA; Device Class L3: unset; Temperature Range Low: -65°C; Temperature: -65°C to +150°C; Device Class L2: TVS Diodes
D2 = CMP-004-00032-1: Diode Schottky 40V 10A 3Pin PowerDI 5; MF: Diodes Inc.; Design Item ID: PDS1040-13; Case/Package: PowerDIâ„¢-5 Diodes Inc.; Pins: 3; Component Type: Standard; MP: PDS1040-13; Check_prices: https://www.snapeda.com/parts/PDS1040-13/Diodes+Inc./view-part/?ref=eda; Value: *; SnapEDA_Link: https://www.snapeda.com/parts/PDS1040-13/Diodes+Inc./view-part/?ref=snap; Source: PDS1040-13.SchLib
R18 = CMP-2002-08143-1: Manufacturer: Vishay Dale; Part Number: CRCW040210R0FKED
R19 R24 = CMP-02407-012085-1: RES 10K OHM 1% 1/16W 0402; Temperature Coefficient: 100ppm/°C; Power Rating: 62.5mW; Resistance: 10kR; Lead Free: Lead Free; Max Operating Temperature: 155°C; RoHS Compliant: Yes; Mount: Surface Mount; Min Operating Temperature: -55°C; Termination: Wraparound; Length: 1mm; Resistor Type: Thick Film; Contact Plating: Tin; Tolerance: 1%; Case/Package: Molded
R20 = CMP-2002-08123-3: RES Thick Film, 100kΩ, 1%, 0.063W, 100ppm/°C, 0402; Power Rating: 63mW; Resistance: 100kR; Voltage Rating (DC): 50V; Lead Free: Lead Free; Height: 0.35mm; Contact Plating: Tin; Min Operating Temperature: -55°C; Package Quantity: 10000; Case/Package: 0402; Temperature Coefficient: 100ppm/°C; Number of Terminations: 2; Packaging: Tape and Reel; Max Power Dissipation: 63mW; Case Code (Metric): 1005; Mount: Surface Mount; Width: 0.02inch; Termination: SMD/SMT; Length: 1mm; Number of Pins: 2; Weight: 2.3E-05oz; Radiation Hardening: No; Tolerance: 1%; Military Standard: Not; Features: Automotive AEC-Q200; Depth: 0.5mm; Composition: Thick Film; Max Operating Temperature: 155°C; Voltage Rating: 50V; Case Code (Imperial): 0402
R21 = CMP-2002-02883-2: RES SMD 48.7K OHM 0.1% 1/16W; Manufacturer: Yageo; Value: 48.7KΩ; Power Rating: 0.063W; Voltage Rating: 50V; Tolerance: 0.001; Temperature Coefficient: 25 ppm/°C; Package: RT0402; Temperature Range Low: -55°C; ComponentLink2Description: Datasheet; Composition: Thin Film; Footprint Url: http://www.yageo.com/exep/pages/download/literatures/PYu-R_Mount_10.pdf; Temperature: -55°C to +155°C; Octopart: https://octopart.com/rt0402brd0748k7l-yageo-1374792; Device Class L3: Chip SMD Resistors; Manufacturer Part Number: RT0402BRD0748K7L; Automotive: No; Height: 0.35mm; Category: Res; Resistance: 48.7KΩ; Lead Free: Yes; Mouser Description: Thin Film Resistors - SMD 1/16W 48.7K ohm .1% 25ppm; Device Class L2: Resistors; Series: RT; ComponentLink2URL: http://www.yageo.com/documents/recent/PYu-RT_1-to-0.01_RoHS_L_9.pdf; Ipc Land Pattern Name: RESC10050X30; RoHS: TRUE; Device Class L1: Passive Components; Digikey Description: RES SMD 48.7K OHM 0.1% 1/16W; Temperature Range High: +155°C
R22 = CMP-2002-07708-2: RES 499 OHM 1% 1/16W 0402; Power Rating: 62.5mW; Voltage Rating: 50V; Max Power Dissipation: 63mW; Temperature Coefficient: 100ppm/°C; Resistance: 499R; Width: 0.02inch; Resistance Tolerance: 1%; Package Quantity: 1; Military Standard: Not; Resistor Type: Thick Film; Height: 0.016inch; Features: Moisture Resistant; Lead Free: Lead Free; Case Code (Metric): 1005; Series: RC; REACH SVHC: No SVHC; Packaging: Tape and Reel; Depth: 0.5mm; Size Code: 0402; Min Operating Temperature: -55°C; Voltage Rating (DC): 50V; Max Operating Temperature: 155°C; Termination: SMD/SMT; Length: 0.039inch; RoHS Compliant: Yes; Case Code (Imperial): 0402; Construction: Rectangular; Number of Terminations: 2; Tolerance: 1%; Case/Package: 0402
R23 = CMP-009-00180-1: Resistor, SMD 1 kOhm 0603 0.1 %; MP: ERA-3AEB102V; Value: 1k; MF: Panasonic; Digi-Key_Part_Number: P1.0KDBCT-ND; Check_prices: https://www.snapeda.com/parts/ERA-3AEB102V/Panasonic%20Electronic%20Components/view-part/260476/?ref=eda; Case/Package: 1608-2 Panasonic; Design Item ID: ERA3AEB102V; Component Type: Standard; Pins: 2; SnapEDA_Link: https://www.snapeda.com/parts/ERA-3AEB102V/Panasonic%20Electronic%20Components/view-part/260476/?ref=snap; Source: ERA3AEB102V.SchLib
R25 = CMP-2002-08314-3: 63mW Thick Film Resistors 75V ±1% ±100ppm/℃ 1MΩ 0402 Chip Resistor - Surface Mount ROHS; Voltage Rating: 50V; Temperature Coefficient: 100ppm/°C; Ratings: AEC-Q200; Width: 500µm; Contact Plating: Tin; Max Power Dissipation: 63mW; Max Operating Temperature: 155°C; Lifecycle Status: Production; ComponentLink2URL: http://www.vishay.com/docs/20035/dcrcwe3.pdf; Power Rating: 63mW; Height: 350µm; Termination: SMD/SMT; Min Operating Temperature: -55°C; Lead Free: Lead Free; Packaging: Cut Tape; Depth: 500µm; Tolerance: 1%; Mount: Surface Mount; Number of Pins: 2; Number of Terminals: 2; ComponentLink1Description: Manufacturer's Website; Working Voltage: 50V; China RoHS: Non-Compliant; Schedule B: 8533210045, 8533210045; HelpURL: http://www.vishay.com/docs/20035/dcrcwe3.pdf; RoHS: Compliant; ComponentLink2Description: Datasheet URL; Number of Terminations: 2; Case Code (Imperial): 0402; Weight: 652.039032µg; Military Standard: Not; Resistance: 1MΩ; Voltage Rating (DC): 50V; Case/Package: 0402; ComponentLink1URL: http://www.vishay.com; Radiation Hardening: No; Features: Automotive AEC-Q200; Composition: Thick Film; Length: 1mm; REACH SVHC: Yes
R26 = CMP-2002-08171-2: RES Thick Film, 121kΩ, 1%, 0.063W, 100ppm/°C, 0402; Voltage Rating (DC): 50V; Max Power Dissipation: 63mW; Resistance: 121kR; Military Standard: Not; Weight: 2.3E-05oz; Termination: SMD/SMT; Case Code (Metric): 1005; Width: 0.5mm; Tolerance: 1%; Contact Plating: Tin; Temperature Coefficient: 100ppm/°C; Depth: 0.5mm; Length: 1mm; Package Quantity: 10; Radiation Hardening: No; Packaging: Tape and Reel; Power Rating: 63mW; Features: Automotive AEC-Q200; Lead Free: Lead Free; Composition: Thick Film; Min Operating Temperature: -55°C; Height: 0.35mm; Voltage Rating: 50V; Case/Package: 0402; Number of Terminations: 2; Max Operating Temperature: 155°C; Case Code (Imperial): 0402
R27 = CMP-2100-03664-2: as R6 on sheet MCU_IMU; Depth: 0.8mm; Termination: SMD/SMT; Resistor Type: Thick Film; Series: RC; Construction: Rectangular; Features: Moisture Resistant; Packaging: Tape and Reel; Min Operating Temperature: -55°C; Number of Terminations: 2; Lead Pitch: 0.3mm; RoHS Compliant: Yes; Case/Package: 0603; Resistance Tolerance: 1%; Military Standard: Not; Weight: 7.1E-05oz; Number of Pins: 2; Tolerance: 1%; Length: 1.6mm; Case Code (Imperial): 0603; Lead Free: Lead Free; Width: 0.8mm; Max Power Dissipation: 100mW; Height: 0.45mm; Max Operating Temperature: 155°C; Case Code (Metric): 1608; Size Code: 0603
R28-R31 RADC = CMP-2100-03615-2: as R1 on sheet MCU_IMU; Termination: SMD/SMT; Weight: 0.000194oz; Case/Package: 0805; Number of Terminations: 2; Min Operating Temperature: -55°C; Case Code (Metric): 2012; Package Quantity: 10; Depth: 1.25mm; Military Standard: Not; Composition: Thick Film; Radiation Hardening: No; Contact Plating: Tin; Height: 0.45mm; Power Rating: 125mW; Features: Automotive AEC-Q200; Tolerance: 1%; Packaging: Tape and Reel; Max Operating Temperature: 155°C; Length: 2mm; Case Code (Imperial): 0805; Voltage Rating (DC): 150V; Width: 1.25mm; Temperature Coefficient: 100ppm/°C; Lead Free: Lead Free
U16 = CMP-027-000000-2: 4.5-V to 16-V, 0.59-mÎ©, 80-A stackable compact eFuse with accurate and fast current monitor 26-VQFN-HR -40 to 125; Manufacturer_Name: Texas Instruments; Manufacturer_Part_Number: TPS259851RQPR; Source: TPS259851RQPR.SchLib; TYPE: TYPE; Design Item ID: TPS259851RQPR; Copyright: Copyright (C) 2025 Ultra Librarian. All rights reserved.; RefDes: RefDes